# EasyEDA Pro project ProProject_步进驱动V1.1.02_2023-12-25.epro

# Schematic Schematic1
Create Date: 2023-08-16; Page Name: P1; Project Name: 步进驱动V1.1.02; Schematic Name: Schematic1; Update Date: 2023-08-25; Company: 嘉立创EDA; Page Size: A4; Version: V1.0
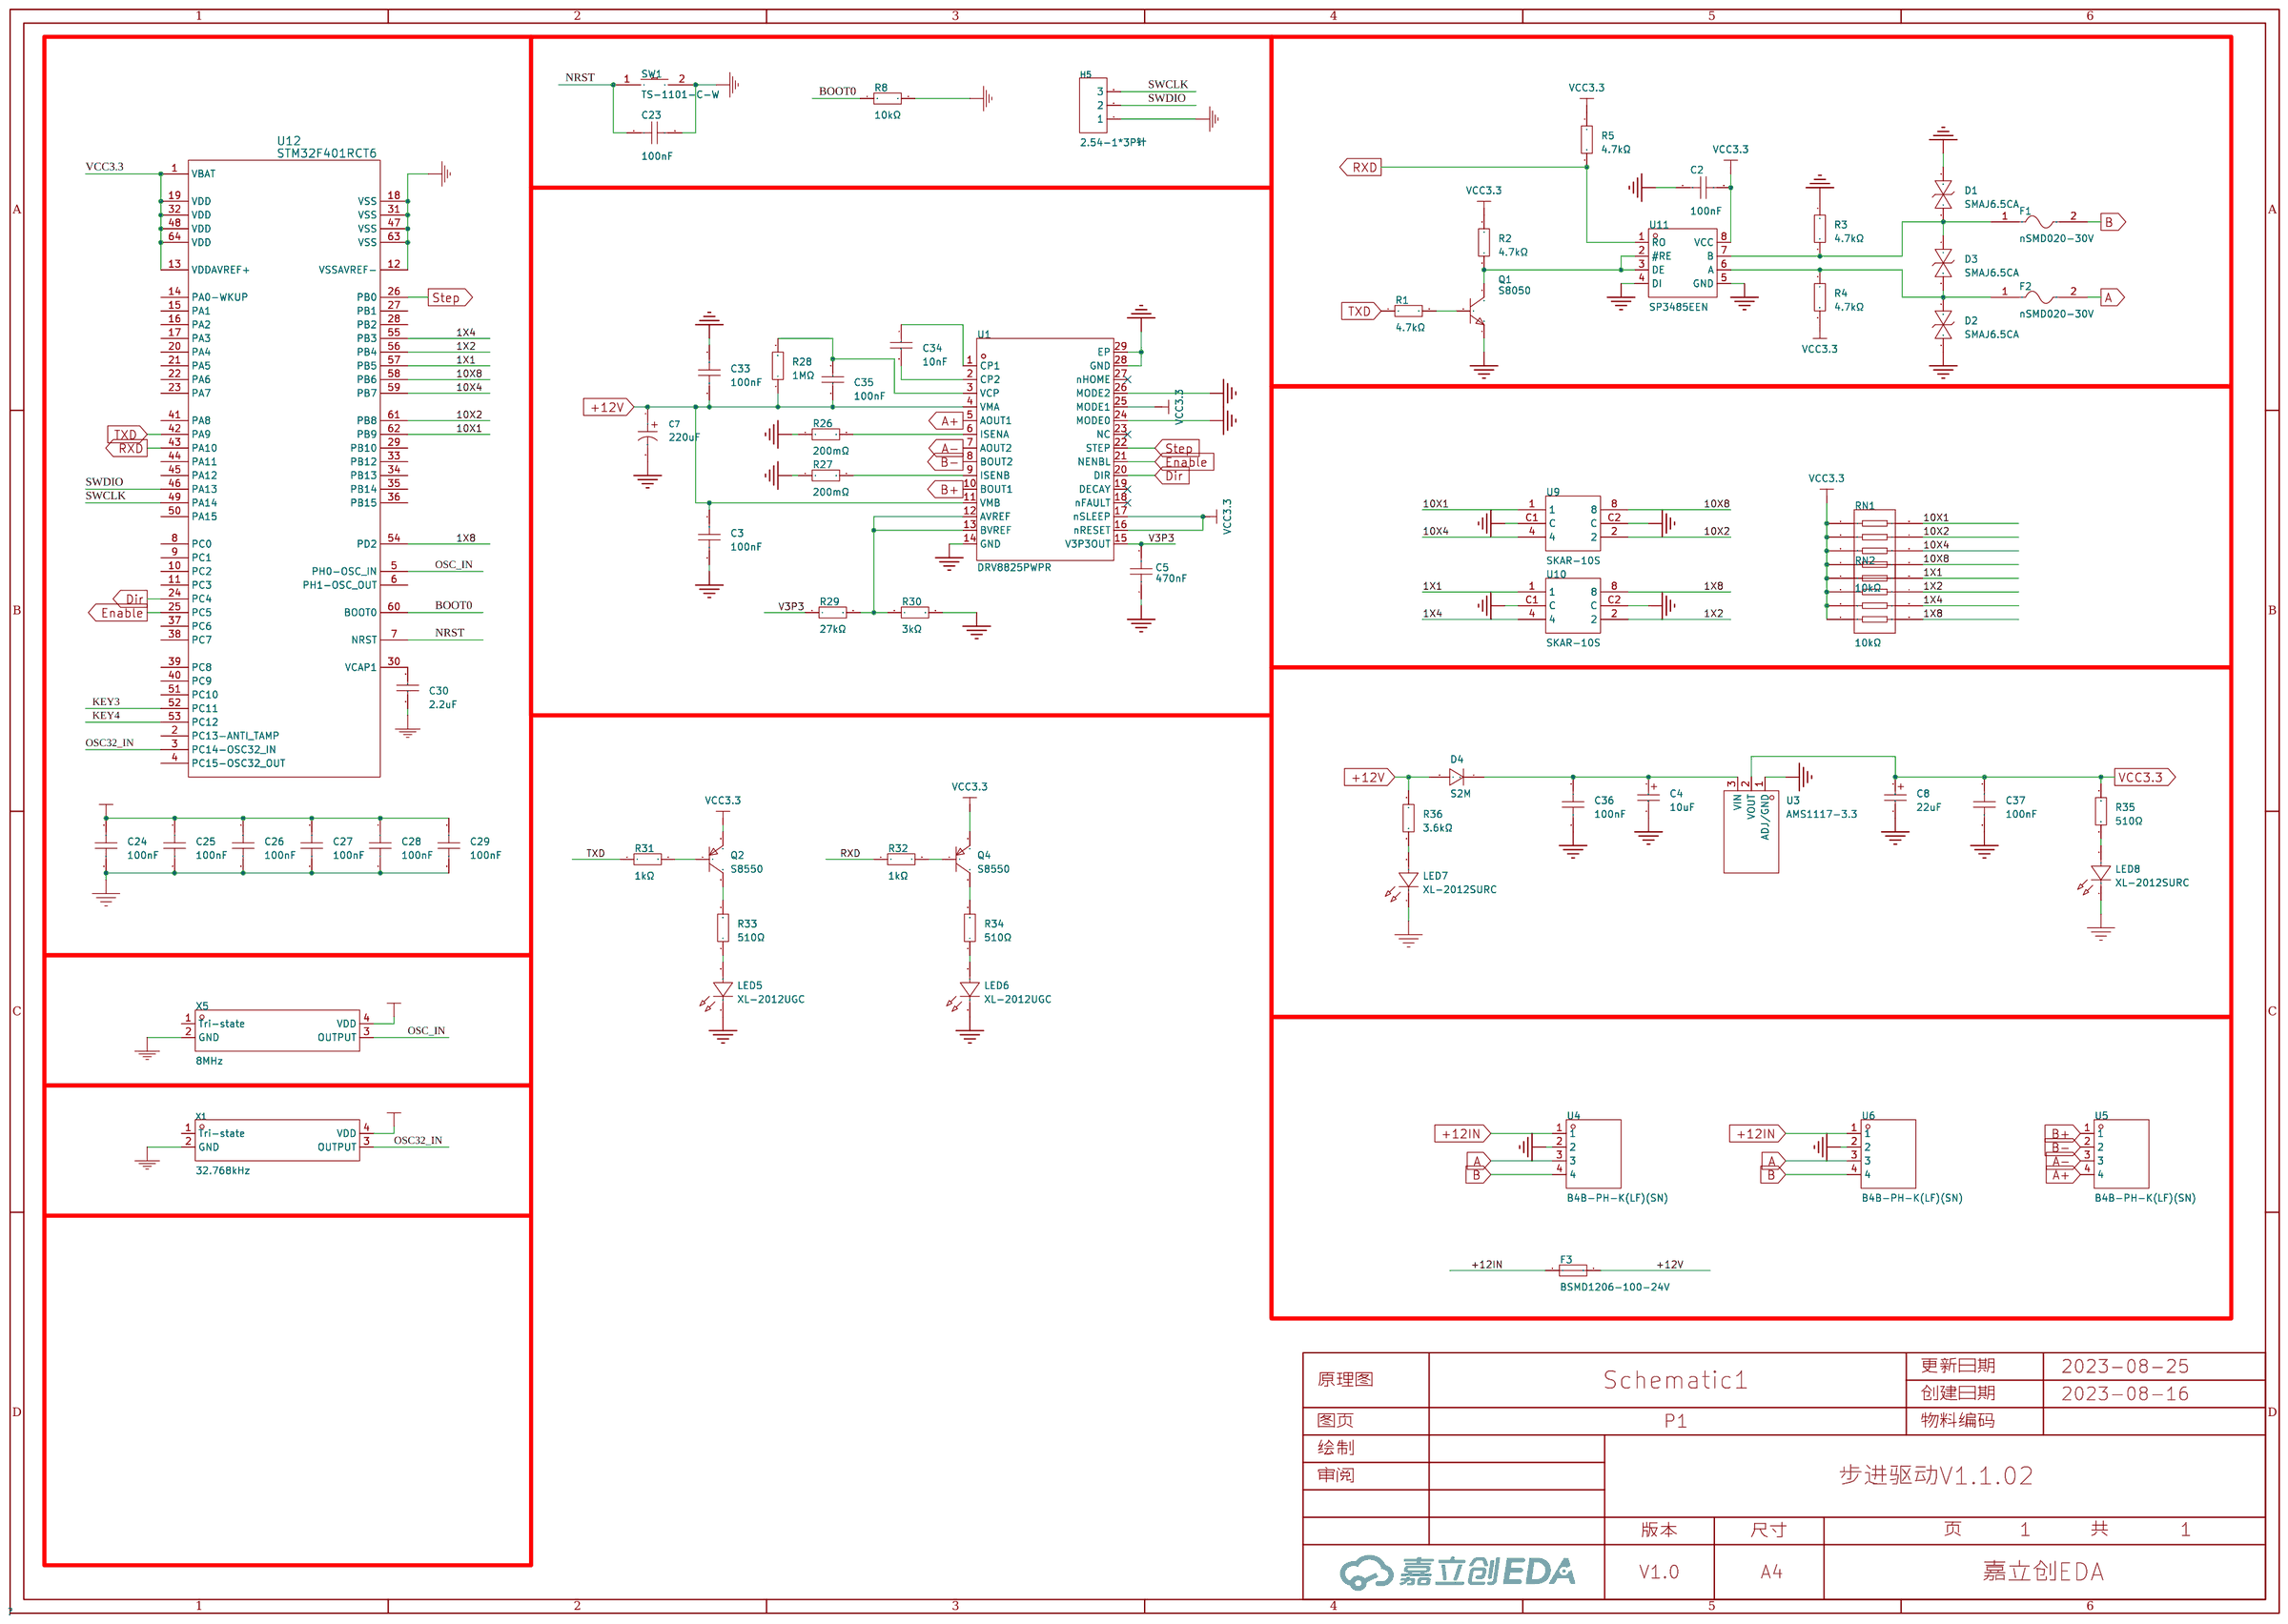
[diagram p0: schematic sheet]

## Parts
C2  100nF  [C0603]
C3  100nF  [C0603]
C4  10uF  [CAP-SMD_L3.2-W1.6-RD]
C5  470nF  [C0603]
C7  220uF  [CAP-SMD_BD6.3-L6.6-W6.6-FD]
C8  22uF  [CAP-SMD_L3.5-W2.8-R-RD]
C23  100nF  [C0603]
C24  100nF  [C0603]
C25  100nF  [C0603]
C26  100nF  [C0603]
C27  100nF  [C0603]
C28  100nF  [C0603]
C29  100nF  [C0603]
C30  2.2uF  [C0603]
C33  100nF  [C0603]
C34  10nF  [C0603]
C35  100nF  [C0603]
C36  100nF  [C0603]
C37  100nF  [C0603]
D1  SMAJ6.5CA  [SMA_L4.3-W2.5-LS5.0-BI]
D2  SMAJ6.5CA  [SMA_L4.3-W2.5-LS5.0-BI]
D3  SMAJ6.5CA  [SMA_L4.3-W2.5-LS5.0-BI]
D4  S2M  [SMA_L4.4-W2.8-LS5.4-RD]
F1  nSMD020-30V  [F1206]
F2  nSMD020-30V  [F1206]
F3  BSMD1206-100-24V  [F1206]
H5  2.54-1*3P针  [HDR-TH_3P-P2.54-V-M-1]
LED5  XL-2012UGC  [LED0805-RD_GREEN]
LED6  XL-2012UGC  [LED0805-RD_GREEN]
LED7  XL-2012SURC  [LED0805-RD_RED]
LED8  XL-2012SURC  [LED0805-RD_RED]
Q1  S8050  [SOT-23-3_L2.9-W1.6-P1.90-LS2.8-BR]
Q2  S8550  [SOT-23-3_L2.9-W1.6-P1.90-LS2.8-BR]
Q4  S8550  [SOT-23-3_L2.9-W1.6-P1.90-LS2.8-BR]
R1  4.7kΩ  [R0603]
R2  4.7kΩ  [R0603]
R3  4.7kΩ  [R0603]
R4  4.7kΩ  [R0603]
R5  4.7kΩ  [R0603]
R8  10kΩ  [R0603]
R26  200mΩ  [R0603]
R27  200mΩ  [R0603]
R28  1MΩ  [R0603]
R29  27kΩ  [R0603]
R30  3kΩ  [R0603]
R31  1kΩ  [R0603]
R32  1kΩ  [R0603]
R33  510Ω  [R0603]
R34  510Ω  [R0603]
R35  510Ω  [R0603]
R36  3.6kΩ  [R0603]
RN1  10kΩ  [RES-ARRAY-SMD_0603-8P-L3.2-W1.6-BL]
RN2  10kΩ  [RES-ARRAY-SMD_0603-8P-L3.2-W1.6-BL]
SW1  TS-1101-C-W  [SW-SMD_L6.0-W3.3-LS8.0]
U1  DRV8825PWPR  [HTSSOP-28_L9.7-W4.4-P0.65-LS6.4-BL-EP]
U3  AMS1117-3.3  [SOT-89-3_L4.5-W2.5-P1.50-LS4.2-BR]
U4  B4B-PH-K(LF)(SN)  [CONN-TH_B4B-PH-K-LF-SN]
U5  B4B-PH-K(LF)(SN)  [CONN-TH_B4B-PH-K-LF-SN]
U6  B4B-PH-K(LF)(SN)  [CONN-TH_B4B-PH-K-LF-SN]
U9  SKAR-10S  [SW-SMD_SKAR-10S]
U10  SKAR-10S  [SW-SMD_SKAR-10S]
U11  SP3485EEN  [SOP-8_L5.0-W4.0-P1.27-LS6.0-BL]
U12  STM32F401RCT6  [LQFP-64_L10.0-W10.0-P0.50-LS12.0-BL]
X1  32.768kHz  [OSC-SMD_4P-L3.2-W2.5-BL_SIT8008BI]
X5  8MHz  [OSC-SMD_4P-L3.2-W2.5-BL]

## Library data of the parts
C2 C3 C23-C29 C33 C36 C37 = CC0603KRX7R9BB104: 容值:100nF;精度:±10%;额定电压:50V;材质(温度系数):X7R;; LCSC Part Name: 100nF ±10% 50V; Supplier Part: C14663; Manufacturer: YAGEO(国巨); Supplier Footprint: 0603; JLCPCB Part Class: 基础库; Datasheet: https://atta.szlcsc.com/upload/public/pdf/source/20180910/C282072_33301C7F631E79921B82A8DAC6BCC5B3.pdf; Supplier: LCSC; Tolerance: ±10%; Voltage Rated: 50V; Temperature Coefficient: X7R
C4 = CA45-A-16V-10uF-K: 容值:10uF;精度:±10%;额定电压:16V;等效串联电阻:10Ω@100kHz;; LCSC Part Name: 10uF ±10% 16V; Supplier Part: C128254; Manufacturer: CEC(振华新云); Supplier Footprint: CASE-A-3216; JLCPCB Part Class: 扩展库; Datasheet: https://atta.szlcsc.com/upload/public/pdf/source/20170914/C128254_1505359752472967905.pdf; Supplier: LCSC; Tolerance: ±10%; Rated Voltage: 16V; Equivalent Series Resistance(ESR): 10Ω@100kHz; Operating Temperature: -55℃~+125℃
C5 = CC0603KRX5R5BB474: 容值:470nF;精度:±10%;额定电压:6.3V;材质(温度系数):X5R;; LCSC Part Name: 470nF ±10% 6.3V; Supplier Part: C327224; Manufacturer: YAGEO(国巨); Supplier Footprint: 0603; JLCPCB Part Class: 扩展库; Supplier: LCSC; Tolerance: ±10%; Voltage Rated: 6.3V; Temperature Coefficient: X5R
C7 = RVT220UF16V67RV0015: 容值:220uF;精度:±20%;额定电压:16V;纹波电流:110mA@120Hz;等效串联电阻:-;; LCSC Part Name: 220uF ±20% 16V; Supplier Part: C2887273; Manufacturer: KNSCHA(科尼盛); Supplier Footprint: SMD,D6.3xL7.7mm; JLCPCB Part Class: 扩展库; Datasheet: https://atta.szlcsc.com/upload/public/pdf/source/20210824/3DC9999D9B098FE241E3A26137981C4C.pdf; Supplier: LCSC; Tolerance: ±20%; Rated Voltage: 16V; φD: 6.3mm; L: 7.7mm; Ripple Current: 110mA@120Hz; Lifetime @ Temp: 2000hrs@105℃; Operating Temperature: -55℃~+105℃
C8 = CA45-B016K226T: 容值:22uF;精度:±10%;额定电压:16V;等效串联电阻:2.2Ω@100kHz;; LCSC Part Name: 22uF ±10% 16V; Supplier Part: C122226; Manufacturer: 湘怡中元/湘江; Supplier Footprint: CASE-B-3528; JLCPCB Part Class: Extended Part; Datasheet: https://atta.szlcsc.com/upload/public/pdf/source/20181017/C122226_7DF2DDC4632F4396103DFFBF0BD6155C.pdf; Supplier: LCSC; Tolerance: ±10%; Rated Voltage: 16V; Equivalent Series Resistance(ESR): 2.2Ω@100kHz; Operating Temperature: -55℃~+125℃
C30 = 0603B225K250NT: 容值:2.2uF;精度:±10%;额定电压:25V;材质(温度系数):X7R;; LCSC Part Name: 2.2uF ±10% 25V; Supplier Part: C99228; Manufacturer: FH(风华); Supplier Footprint: 0603; JLCPCB Part Class: 扩展库; Datasheet: https://atta.szlcsc.com/upload/public/pdf/source/20170923/C99228_1506149582167989005.pdf; Supplier: LCSC; Tolerance: ±10%; Voltage Rated: 25V; Temperature Coefficient: X7R
C34 = CC0603KRX7R9BB103: 容值:10nF;精度:±10%;额定电压:50V;材质(温度系数):X7R;; LCSC Part Name: 10nF ±10% 50V; Supplier Part: C100042; Manufacturer: YAGEO(国巨); Supplier Footprint: 0603; JLCPCB Part Class: 扩展库; Datasheet: https://atta.szlcsc.com/upload/public/pdf/source/20180326/C100042_E8B0111D51DE3671A0A4A59FBCEFE81C.pdf; Supplier: LCSC; Tolerance: ±10%; Voltage Rated: 50V; Temperature Coefficient: X7R
C35 = CL10B104KO8NNNC: 容值:100nF;精度:±10%;额定电压:16V;材质(温度系数):X7R;; LCSC Part Name: 100nF ±10% 16V; Supplier Part: C66501; Manufacturer: SAMSUNG(三星); Supplier Footprint: 0603; JLCPCB Part Class: 扩展库; Datasheet: https://atta.szlcsc.com/upload/public/pdf/source/20160218/1457707763339.pdf; Supplier: LCSC; Tolerance: ±10%; Voltage Rated: 16V; Temperature Coefficient: X7R
D1-D3 = SMAJ6.5CA_C726773: 极性:双向;; LCSC Part Name: 双向; Supplier Part: C726773; Manufacturer: TWGMC(台湾迪嘉); Supplier Footprint: SMA; JLCPCB Part Class: 扩展库; Datasheet: https://atta.szlcsc.com/upload/public/pdf/source/20200827/C726731_3930C18E0BE7F90724BF034A8102E5CA.pdf; Supplier: LCSC; Polarity: 双向
D4 = S2M_C18905: 二极管配置:-;直流反向耐压(Vr):1kV;平均整流电流(Io):2A;正向压降(Vf):1.1V@2A;反向电流(Ir):5uA@1kV;; LCSC Part Name: 1kV 2A 1.1V@2A; Supplier Part: C18905; Manufacturer: MDD; Supplier Footprint: SMA(DO-214AC); JLCPCB Part Class: 扩展库; Datasheet: https://atta.szlcsc.com/upload/public/pdf/source/20230314/14BD280075F8F5C2EBB2216FE456DD68.pdf; Supplier: LCSC; Reverse Voltage (Vr): 1kV; Average Rectified Current (Io): 2A; Forward Voltage (Vf@If): 1.1V@2A; Reverse Leakage Current: 5uA@1kV
F1 F2 = nSMD020-30V: 最大电压:30V;最大电流:100A;保持电流:200mA;跳闸电流:460mA;; LCSC Part Name: 30V 200mA 1206自恢复; Supplier Part: C69680; Manufacturer: 台湾陆海; Supplier Footprint: 1206; JLCPCB Part Class: 扩展库; Datasheet: https://atta.szlcsc.com/upload/public/pdf/source/20230404/9F5B471D89C649BCC2835D46521A6324.pdf; Supplier: LCSC; Operating Voltage (Max): 30V; Current Rating (Max): 100A; Hold Current: 200mA; Trip Current: 460mA
F3 = BSMD1206-100-24V: 最大电压:24V;最大电流:40A;保持电流:1A;跳闸电流:1.8A;消耗功率:600mW;初始态阻值(最小值):50mΩ;跳断后阻值(最大值):270mΩ;最大动作时间:300ms;工作温度:-40℃~+85℃;; LCSC Part Name: 1206 1A 24V 佰宏高电压; Supplier Part: C910830; Manufacturer: BHFUSE(佰宏); Supplier Footprint: 1206; JLCPCB Part Class: 扩展库; Datasheet: https://atta.szlcsc.com/upload/public/pdf/source/20220223/F3912435B50C2DF93D2E2177EFAD108D.pdf; Supplier: LCSC; Operating Voltage (Max): 24V; Current Rating (Max): 40A; Hold Current: 1A; Trip Current: 1.8A; Power Dissipation: 600mW; Resistance - Initial (Ri) (Min): 50mΩ; Resistance - Post Trip (R1) (Max): 270mΩ; Maximum Time to Trip: 300ms; Operating Temperature: -40℃~+85℃
H5 = 2.54-1*3P针: 排数:单排;总PIN位数:3;间距:2.54mm;插针结构:1x3P;行距:-;安装类型:直插;圆针/方针:方针;额定电流:3A;额定电压:-;配合针长度:-;塑高:-;端接针长度:-;触头材质:-;触头镀层:-;工作温度范围:-40℃~+105℃;颜色:黑色;; LCSC Part Name: 2.54mm 1x3P 直插 方针; Supplier Part: C49257; Manufacturer: BOOMELE(博穆精密); Supplier Footprint: 直插,P=2.54mm; JLCPCB Part Class: 扩展库; Supplier: LCSC; Number of Rows: 单排; Number of Pins: 3; Pitch: 2.54mm; Pin Structure: 1x3P; Mounting Type: 直插; Circluar Pins/Square Pins: 方针; Current Rating (Max): 3A; Operating Temperature Range: -40℃~+105℃; Color: 黑色
LED5 LED6 = XL-2012UGC: 发光颜色:翠绿;主波长:516nm~525nm;色温:-;功率:80mW;安装方式:正贴;; LCSC Part Name: 翠绿 正贴; Supplier Part: C965815; Manufacturer: XINGLIGHT(成兴光); Supplier Footprint: 0805; JLCPCB Part Class: 扩展库; Datasheet: https://atta.szlcsc.com/upload/public/pdf/source/20221102/ACA6CBC413A1A8AF38BEBA54306464BE.pdf; Supplier: LCSC; Emitted Color: 翠绿; Lens Color: 无色透明; Dominant Wavelength: 516nm~525nm; Peak Wavelength: 534nm; Forward Current: 25mA; Power Dissipation: 80mW; Viewing Angle: 120°; Mounting Sytle: 正贴; Operating Temperature: -30℃~+85℃
LED7 LED8 = XL-2012SURC: 发光颜色:红灯;主波长:617nm~621nm;色温:-;功率:55mW;安装方式:正贴;; LCSC Part Name: 红灯 正贴; Supplier Part: C965812; Manufacturer: XINGLIGHT(成兴光); Supplier Footprint: 0805; JLCPCB Part Class: 扩展库; Datasheet: https://atta.szlcsc.com/upload/public/pdf/source/20221102/49E1A0A365644091E6270AF1C5E0FE37.pdf; Supplier: LCSC; Emitted Color: 红灯; Lens Color: 无色透明; Dominant Wavelength: 617nm~621nm; Peak Wavelength: 623nm; Forward Current: 25mA; Power Dissipation: 55mW; Viewing Angle: 120°; Mounting Sytle: 正贴; Operating Temperature: -30℃~+85℃
Q1 = S8050_C105433: 晶体管类型:NPN;集射极击穿电压(Vceo):25V;集电极电流(Ic):500mA;功率(Pd):300mW;直流电流增益(hFE@Ic,Vce):120@50mA,1V;; LCSC Part Name: NPN 25V 500mA L档 120-200; Supplier Part: C105433; Manufacturer: CJ(江苏长电/长晶); Supplier Footprint: SOT-23; JLCPCB Part Class: 扩展库; Datasheet: https://atta.szlcsc.com/upload/public/pdf/source/20170415/1492237762328.pdf; Supplier: LCSC; Transistor Type: NPN; Collector-Emitter Breakdown Voltage (Vceo): 25V; Collector Current (Ic): 500mA; Power Dissipation (Pd): 300mW; Collector Cut-Off Current (Icbo): 100nA; Collector-Emitter Saturation Voltage (VCE(sat)@Ic,Ib): 600mV@500mA,50mA; DC Current Gain (hFE@Ic,Vce): 120@50mA,1V; Transition Frequency (fT): 150MHz; Operating Temperature: +150℃@(Tj)
Q2 Q4 = S8550_C105432: 晶体管类型:PNP;集射极击穿电压(Vceo):25V;集电极电流(Ic):500mA;功率(Pd):300mW;直流电流增益(hFE@Ic,Vce):120@50mA,1V;; LCSC Part Name: PNP 25V 500mA L档120-200; Supplier Part: C105432; Manufacturer: CJ(江苏长电/长晶); Supplier Footprint: SOT-23; JLCPCB Part Class: 基础库; Datasheet: https://atta.szlcsc.com/upload/public/pdf/source/20170413/1492062713649.pdf; Supplier: LCSC; Transistor Type: PNP; Collector-Emitter Breakdown Voltage (Vceo): 25V; Collector Current (Ic): 500mA; Power Dissipation (Pd): 300mW; Collector Cut-Off Current (Icbo): 100nA; Collector-Emitter Saturation Voltage (VCE(sat)@Ic,Ib): 600mV@500mA,50mA; DC Current Gain (hFE@Ic,Vce): 120@50mA,1V; Transition Frequency (fT): 150MHz; Operating Temperature: +150℃@(Tj)
R1-R5 = 0603WAF4701T5E: 电阻类型:厚膜电阻;阻值:4.7kΩ;精度:±1%;功率:100mW;; LCSC Part Name: 4.7kΩ ±1% 100mW; Supplier Part: C23162; Manufacturer: UNI-ROYAL(厚声); Supplier Footprint: 0603; JLCPCB Part Class: 基础库; Datasheet: https://atta.szlcsc.com/upload/public/pdf/source/20200306/C422600_1E6D84923E4A46A82E41ADD87F860B5C.pdf; Supplier: LCSC; Type: 厚膜电阻; Tolerance: ±1%; Power(Watts): 100mW; Temperature Coefficient: ±100ppm/℃; Overload Voltage (Max): 75V; Operating Temperature Range: -55℃~+155℃
R8 = 0603WAF1002T5E: 电阻类型:厚膜电阻;阻值:10kΩ;精度:±1%;功率:100mW;; LCSC Part Name: 厚膜电阻 10kΩ ±1% 100mW; Supplier Part: C25804; Manufacturer: UNI-ROYAL(厚声); Supplier Footprint: 0603; JLCPCB Part Class: 基础库; Datasheet: https://atta.szlcsc.com/upload/public/pdf/source/20200306/C422600_1E6D84923E4A46A82E41ADD87F860B5C.pdf; Supplier: LCSC; Type: 厚膜电阻; Tolerance: ±1%; Power(Watts): 100mW; Temperature Coefficient: ±100ppm/℃; Overload Voltage (Max): 75V; Operating Temperature Range: -55℃~+155℃
R26 R27 = 0603WAF200LT5E: 电阻类型:厚膜电阻;阻值:200mΩ;精度:±1%;功率:100mW;; LCSC Part Name: 200mΩ ±1% 100mW; Supplier Part: C79773; Manufacturer: UNI-ROYAL(厚声); Supplier Footprint: 0603; JLCPCB Part Class: 扩展库; Datasheet: https://atta.szlcsc.com/upload/public/pdf/source/20200306/C422600_1E6D84923E4A46A82E41ADD87F860B5C.pdf; Supplier: LCSC; Type: 厚膜电阻; Tolerance: ±1%; Power(Watts): 100mW; Temperature Coefficient: ±800ppm/℃; Overload Voltage (Max): 75V; Operating Temperature Range: -55℃~+155℃
R28 = 0603WAF1004T5E: 电阻类型:厚膜电阻;阻值:1MΩ;精度:±1%;功率:100mW;; LCSC Part Name: 1MΩ ±1% 100mW; Supplier Part: C22935; Manufacturer: UNI-ROYAL(厚声); Supplier Footprint: 0603; JLCPCB Part Class: 基础库; Datasheet: https://atta.szlcsc.com/upload/public/pdf/source/20200306/C422600_1E6D84923E4A46A82E41ADD87F860B5C.pdf; Supplier: LCSC; Type: 厚膜电阻; Tolerance: ±1%; Power(Watts): 100mW; Temperature Coefficient: ±100ppm/℃; Overload Voltage (Max): 75V; Operating Temperature Range: -55℃~+155℃
R29 = 0603WAF2702T5E: 电阻类型:厚膜电阻;阻值:27kΩ;精度:±1%;功率:100mW;; LCSC Part Name: 27kΩ ±1% 100mW; Supplier Part: C22967; Manufacturer: UNI-ROYAL(厚声); Supplier Footprint: 0603; JLCPCB Part Class: 基础库; Datasheet: https://atta.szlcsc.com/upload/public/pdf/source/20200306/C422600_1E6D84923E4A46A82E41ADD87F860B5C.pdf; Supplier: LCSC; Type: 厚膜电阻; Tolerance: ±1%; Power(Watts): 100mW; Temperature Coefficient: ±100ppm/℃; Overload Voltage (Max): 75V; Operating Temperature Range: -55℃~+155℃
R30 = 0603WAF3001T5E: 电阻类型:厚膜电阻;阻值:3kΩ;精度:±1%;功率:100mW;; LCSC Part Name: 3kΩ ±1% 100mW; Supplier Part: C4211; Manufacturer: UNI-ROYAL(厚声); Supplier Footprint: 0603; JLCPCB Part Class: 基础库; Datasheet: https://atta.szlcsc.com/upload/public/pdf/source/20200306/C422600_1E6D84923E4A46A82E41ADD87F860B5C.pdf; Supplier: LCSC; Type: 厚膜电阻; Tolerance: ±1%; Power(Watts): 100mW; Temperature Coefficient: ±100ppm/℃; Overload Voltage (Max): 75V; Operating Temperature Range: -55℃~+155℃
R31 R32 = 0603WAF1001T5E: 电阻类型:厚膜电阻;阻值:1kΩ;精度:±1%;功率:100mW;; LCSC Part Name: 1kΩ ±1% 100mW; Supplier Part: C21190; Manufacturer: UNI-ROYAL(厚声); Supplier Footprint: 0603; JLCPCB Part Class: 基础库; Datasheet: https://atta.szlcsc.com/upload/public/pdf/source/20200306/C422600_1E6D84923E4A46A82E41ADD87F860B5C.pdf; Supplier: LCSC; Type: 厚膜电阻; Tolerance: ±1%; Power(Watts): 100mW; Temperature Coefficient: ±100ppm/℃; Overload Voltage (Max): 75V; Operating Temperature Range: -55℃~+155℃
R33-R35 = 0603WAF5100T5E: 电阻类型:厚膜电阻;阻值:510Ω;精度:±1%;功率:100mW;; LCSC Part Name: 510Ω ±1% 100mW; Supplier Part: C23193; Manufacturer: UNI-ROYAL(厚声); Supplier Footprint: 0603; JLCPCB Part Class: Basic Part; Datasheet: https://atta.szlcsc.com/upload/public/pdf/source/20200306/C422600_1E6D84923E4A46A82E41ADD87F860B5C.pdf; Supplier: LCSC; Type: 厚膜电阻; Tolerance: ±1%; Power(Watts): 100mW; Temperature Coefficient: ±100ppm/℃; Overload Voltage (Max): 75V; Operating Temperature Range: -55℃~+155℃
R36 = 0603WAF3601T5E: 电阻类型:厚膜电阻;阻值:3.6kΩ;精度:±1%;功率:100mW;; LCSC Part Name: 3.6kΩ ±1% 100mW; Supplier Part: C22980; Manufacturer: UNI-ROYAL(厚声); Supplier Footprint: 0603; JLCPCB Part Class: Basic Part; Datasheet: https://atta.szlcsc.com/upload/public/pdf/source/20200306/C422600_1E6D84923E4A46A82E41ADD87F860B5C.pdf; Supplier: LCSC; Type: 厚膜电阻; Tolerance: ±1%; Power(Watts): 100mW; Temperature Coefficient: ±100ppm/℃; Overload Voltage (Max): 75V; Operating Temperature Range: -55℃~+155℃
RN1 RN2 = 4D03WGJ0103T5E: 阻值:10kΩ;精度:±5%;单个元件功率:62.5mW;电阻器数:4;; LCSC Part Name: 10kΩ ±5%; Supplier Part: C29718; Manufacturer: UNI-ROYAL(厚声); Supplier Footprint: 0603x4; JLCPCB Part Class: 基础库; Datasheet: https://atta.szlcsc.com/upload/public/pdf/source/20170615/1497511005633.pdf; Supplier: LCSC; Tolerance: ±5%; Power(Watts): 62.5mW; Number of Resistors: 4; Number of Pins: 8; Temperature Coefficient: ±200ppm/℃
SW1 = TS-1101-C-W: 触点电流:50mA;额定电压(AC):-;额定电压(DC):12V;额定功率:-;绝缘电阻:-;电路结构:单刀单掷;安装方式:立贴;带灯:无;作用力:260gf;机械寿命:5万次;带支架:否;; LCSC Part Name: 立贴 6*3.6*2.5mm 轻触开关 一型3*6*2.5有白ZD b拉伸白色带淡绿按键 卷装; Supplier Part: C318938; Manufacturer: XKB Connectivity(中国星坤); Supplier Footprint: SMD; JLCPCB Part Class: 扩展库; Datasheet: https://atta.szlcsc.com/upload/public/pdf/source/20200227/C318938_C2E53B1EEDE37D980A33616AC086DE53.pdf; Supplier: LCSC; Contact Current: 50mA; Voltage Rating (DC): 12V; Circuit: 单刀单掷; Mounting Style: 立贴; Actuator Style: 矩形按钮; Actuator/Cap Color: 白色带淡绿; With Lamp: 无; Operating Force: 260gf; Mechanical Life: 5万次; Operating Temperature: -30℃~+85℃; Switch Length: 6mm; Switch Width: 3.6mm; Switch Height: 2.5mm; Strike Gundam: 否
U1 = DRV8825PWPR: 类型:-;电源电压:8.2V~45V;输出电流:2.5A;接口:-;; Supplier Part: C81582; Manufacturer: TI(德州仪器); Supplier Footprint: HTSSOP-28-EP; JLCPCB Part Class: 扩展库; Datasheet: https://atta.szlcsc.com/upload/public/pdf/source/20161207/1481104165111.pdf; Supplier: LCSC; Supply Voltage: 8.2V~45V; Output Current: 2.5A; Operating Temperature: -40℃~+150℃@(Tj)
U3 = AMS1117-3.3_C880752: 输出类型:-;; Supplier Part: C880752; Manufacturer: Slkor(萨科微); Supplier Footprint: SOT-89-3; JLCPCB Part Class: 扩展库; Datasheet: https://atta.szlcsc.com/upload/public/pdf/source/20201231/C426566_7F22DB93439D00F3FA27143E4F28C6AA.pdf; Supplier: LCSC
U4-U6 = B4B-PH-K(LF)(SN): 参考系列:PH;间距:2mm;插针结构:1x4P;排数:1;每排PIN数:4;行距:-;安装方式:-;触头材质:黄铜;; LCSC Part Name: PH 2mm 1x4P; Supplier Part: C265289; Manufacturer: JST; Supplier Footprint: 直插,P=2mm; JLCPCB Part Class: 扩展库; Datasheet: https://atta.szlcsc.com/upload/public/pdf/source/20181024/C265289_8AD58A082EB90E807312EB2A7830A4E1.pdf; Supplier: LCSC; Reference Series: PH; Pitch: 2mm; Pins Structure: 1x4P; Number of Rows: 1; Number of PINs Per Row: 4; Contact Material: 黄铜
U9 U10 = SKAR-10S: 类型:贴片型;; LCSC Part Name: 旋转编码开关/8421开关/BCD编码开关; Supplier Part: C2841466; Manufacturer: SM Switch; Supplier Footprint: SMD; JLCPCB Part Class: 扩展库; Datasheet: https://atta.szlcsc.com/upload/public/pdf/source/20211026/BE4A0CBC2E7B813E59BDAB68EBCE2F29.pdf; Supplier: LCSC; Type: 贴片型
U11 = SP3485EEN: Supplier Part: C668205; Manufacturer: UMW(广东友台半导体); Supplier Footprint: SOP-8; JLCPCB Part Class: 扩展库; Datasheet: https://atta.szlcsc.com/upload/public/pdf/source/20221009/2FEF7A2E83435CC21653A42B67D28760.pdf; Supplier: LCSC
U12 = STM32F401RCT6: Supplier: LCSC; Manufacturer: STMicroelectronics; Supplier Part: C74524; JLCPCB Part Class: Extended Part; link: https://item.szlcsc.com/92458.html; 3DModel: LQFP-64_L10.0-W10.0-H1.4-LS12.0-P0.50
X1 = S3D32.768KB20F30T: 频率:32.768kHz;频率稳定度:±20ppm;工作电压:3.3V;输出模式:CMOS;; LCSC Part Name: 32.768kHz ±20ppm 3.3V CMOS; Supplier Part: C387415; Manufacturer: SCTF(星通时频); Supplier Footprint: SMD3225-4P; JLCPCB Part Class: 扩展库; Datasheet: https://atta.szlcsc.com/upload/public/pdf/source/20220907/EE78A4BA56F6C8FCA9763B3CAD0160B4.pdf; Supplier: LCSC; Frequency Stability: ±20ppm; Supply Voltage: 3.3V; Supply Current (Max): 90uA; Output Type: CMOS; Operating Temperature: -40℃~+85℃
X5 = OT32258MJBA4SL: 频率:8MHz;频率稳定度:±10ppm;工作电压:1.8V~3.3V;; LCSC Part Name: 8MHz ±10ppm 1.8V~3.3V YSO110TR; Supplier Part: C717687; Manufacturer: YXC(扬兴晶振); Supplier Footprint: SMD3225-4P; JLCPCB Part Class: 扩展库; Datasheet: https://atta.szlcsc.com/upload/public/pdf/source/20210329/C669065_30B18CFE780D377BA4E84F6ED1951959.pdf; Supplier: LCSC; Frequency Stability: ±10ppm; Supply Voltage: 1.8V~3.3V; Operating Temperature: -40℃~+85℃

## Nets
+12V: C3.1 C7.1 C33.2 C35.2 D4.2(A) F3.2 R28.1 R36.1 U1.4(VMA) U1.11(VMB)
GND: C2.1 C3.2 C4.2 C5.1 C7.2 C8.2 C23.2 C24.2 C25.2 C26.2 C27.2 C28.2 C29.2 C30.1 C33.1 C36.2 C37.2 D1.1 D2.2 H5.1 LED5.1(K) LED6.1(K) LED7.1(K) LED8.1(K) Q1.2 R3.1 R8.2 R26.1 R27.1 R30.2 SW1.2 U1.14(GND) U1.24(MODE0) U1.26(MODE2) U1.28(GND) U1.29(EP) U3.1(ADJ/GND) U4.2 U6.2 U9.C1(C) U9.C2(C) U10.C1(C) U10.C2(C) U11.4(DI) U11.5(GND) U12.12(VSSAVREF-) U12.18(VSS) U12.31(VSS) U12.47(VSS) U12.63(VSS) X1.2(GND) X5.2(GND)
V3P3: C5.2 R29.1 U1.15(V3P3OUT)
VCC3.3: C2.2 C8.1 C24.1 C25.1 C26.1 C27.1 C28.1 C29.1 C37.1 Q2.2 Q4.2 R2.1 R4.2 R5.1 R35.2 RN1.1 RN1.2 RN1.3 RN1.4 RN2.1 RN2.2 RN2.3 RN2.4 U1.16(nRESET) U1.17(nSLEEP) U1.25(MODE1) U3.2(VOUT) U11.8(VCC) U12.1(VBAT) U12.13(VDDAVREF+) U12.19(VDD) U12.32(VDD) U12.48(VDD) U12.64(VDD) X1.4(VDD) X5.4(VDD)
1X1: RN2.8 U10.1 U12.57(PB5)
1X2: RN2.7 U10.2 U12.56(PB4)
1X4: RN2.6 U10.4 U12.55(PB3)
1X8: RN2.5 U10.8 U12.54(PD2)
10X1: RN1.8 U9.1 U12.62(PB9)
10X2: RN1.7 U9.2 U12.61(PB8)
10X4: RN1.6 U9.4 U12.59(PB7)
10X8: RN1.5 U9.8 U12.58(PB6)
+12IN: F3.1 U4.1 U6.1
A: F2.2 U4.3 U6.3
A+: U1.5(AOUT1) U5.4
A-: U1.7(AOUT2) U5.3
B: F1.2 U4.4 U6.4
B+: U1.10(BOUT1) U5.1
B-: U1.8(BOUT2) U5.2
BOOT0: R8.1 U12.60(BOOT0)
Dir: U1.20(DIR) U12.24(PC4)
Enable: U1.21(NENBL) U12.25(PC5)
KEY3: U12.52(PC11)
KEY4: U12.53(PC12)
NRST: C23.1 SW1.1 U12.7(NRST)
OSC32_IN: U12.3(PC14-OSC32_IN) X1.3(OUTPUT)
OSC_IN: U12.5(PH0-OSC_IN) X5.3(OUTPUT)
RXD: R5.2 R32.1 U11.1(RO) U12.43(PA10)
Step: U1.22(STEP) U12.26(PB0)
SWCLK: H5.3 U12.49(PA14)
SWDIO: H5.2 U12.46(PA13)
TXD: R1.1 R31.1 U12.42(PA9)
$1N1217: Q1.1 R1.2
$1N1218: Q1.3 R2.2 U11.2(#RE) U11.3(DE)
$1N1230: D1.2 D3.1 F1.1 R3.2 U11.7(B)
$1N1231: D2.1 D3.2 F2.1 R4.1 U11.6(A)
$1N2052: C4.1 C36.1 D4.1(C) U3.3(VIN)
$1N2058: LED8.2(A) R35.1
$1N2061: LED7.2(A) R36.2
$1N2619: C30.2 U12.30(VCAP1)
$1N4237: R26.2 U1.6(ISENA)
$1N4238: R27.2 U1.9(ISENB)
$1N4249: C34.2 U1.2(CP2)
$1N4250: C34.1 U1.1(CP1)
$1N4254: C35.1 R28.2 U1.3(VCP)
$1N4266: R29.2 R30.1 U1.12(AVREF) U1.13(BVREF)
$1N6482: Q2.1 R31.2
$1N6521: Q4.1 R32.2
$1N6755: Q2.3 R33.2
$1N6785: Q4.3 R34.2
Net-(LED5-2): LED5.2(A) R33.1
Net-(LED6-2): LED6.2(A) R34.1

Not connected (* = marked no-connect by the designer): U1 18(nFAULT)* 19(DECAY)* 23(NC)* 27(nHOME)*; U12 2(PC13-ANTI_TAMP) 4(PC15-OSC32_OUT) 6(PH1-OSC_OUT) 8(PC0) 9(PC1) 10(PC2) 11(PC3) 14(PA0-WKUP) 15(PA1) 16(PA2) 17(PA3) 20(PA4) 21(PA5) 22(PA6) 23(PA7) 27(PB1) 28(PB2) 29(PB10) 33(PB12) 34(PB13) 35(PB14) 36(PB15) 37(PC6) 38(PC7) 39(PC8) 40(PC9) 41(PA8) 44(PA11) 45(PA12) 50(PA15) 51(PC10); X1 1(Tri-state); X5 1(Tri-state)

# Board PCB1
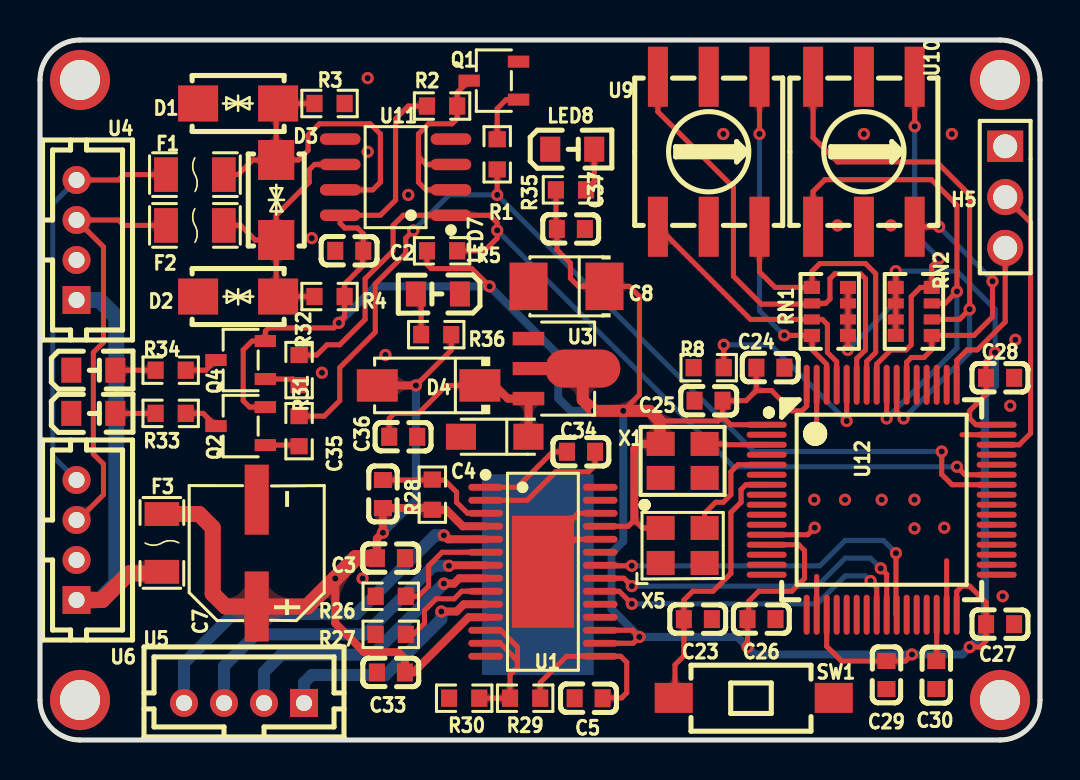
[diagram p1: board, top side]
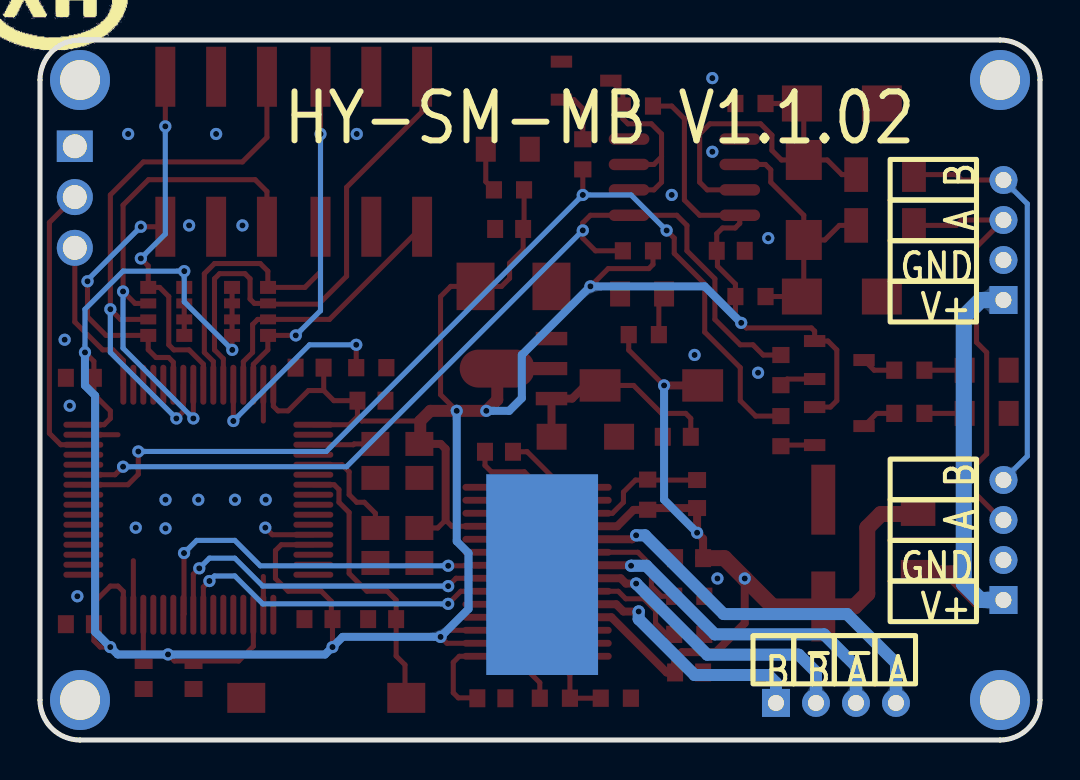
[diagram p2: board, bottom side, seen from below]

Outline 50 x 35 mm; copper layers: Top Layer, Bottom Layer. Coordinates in mm from the lower left corner of the outline.
Outline path: 0,33 0,2 arc(0.59,0.59) 2,0 48,0 arc(49.41,0.59) 50,2 50,33 arc(49.41,34.41) 48,35 2,35 arc(0.59,34.41) 0,33
Stack: Top Layer 0.035mm / Dielectric1 1.51mm FR4 er 4.5 / Bottom Layer 0.035mm

## Design rules (mm)
template: JLCPCB Capability(Two Layers Board)
spacing copperThickness1oz (default): track to track 0.102, other pairs 0.152 to 0.3
spacing copperThickness2oz: track to track 0.203, other pairs 0.152 to 0.3
track width copperThickness1oz (default): min 0.127, default 0.254, max 2.54
track width copperThickness2oz: min 0.203, default 0.254, max 2.54
differential pair differentialPair (default): width min 0.127, default 0.254, max 2.54; gap min 0.152, default 0.152
via viaSize (default): diameter min 0.5, default 0.61, max 10; hole min 0.3, default 0.305, max 6.3

## Placement (name value [footprint] x y rotation side)
C2  100nF  [C0603]  15.46 24.46 0 top
C3  100nF  [C0603]  17.55 9.09 0 top
C4  10uF  [CAP-SMD_L3.2-W1.6-RD]  22.73 15.16 180 top
C5  470nF  [C0603]  27.43 2.09 0 top
C7  220uF  [CAP-SMD_BD6.3-L6.6-W6.6-FD]  10.84 9.35 90 top
C8  22uF  [CAP-SMD_L3.5-W2.8-R-RD]  26.33 22.68 0 top
C23  100nF  [C0603]  32.89 6.04 0 top
C24  100nF  [C0603]  36.52 18.62 0 top
C25  100nF  [C0603]  33.43 16.97 180 top
C26  100nF  [C0603]  36.08 6.04 0 top
C27  100nF  [C0603]  48.01 5.79 0 top
C28  100nF  [C0603]  48.01 18.11 0 top
C29  100nF  [C0603]  42.32 3.25 270 top
C30  2.2uF  [C0603]  44.82 3.25 90 top
C33  100nF  [C0603]  17.55 3.38 0 top
C34  10nF  [C0603]  27.05 14.41 0 top
C35  100nF  [C0603]  17.15 12.3 270 top
C36  100nF  [C0603]  18.16 15.16 0 top
C37  100nF  [C0603]  26.54 25.55 0 top
D1  SMAJ6.5CA  [SMA_L4.3-W2.5-LS5.0-BI]  9.91 31.83 0 top
D2  SMAJ6.5CA  [SMA_L4.3-W2.5-LS5.0-BI]  9.91 22.17 180 top
D3  SMAJ6.5CA  [SMA_L4.3-W2.5-LS5.0-BI]  11.81 27 270 top
D4  S2M  [SMA_L4.4-W2.8-LS5.4-RD]  19.43 17.73 180 top
F1  nSMD020-30V  [F1206]  7.75 28.27 180 top
F2  nSMD020-30V  [F1206]  7.75 25.73 180 top
F3  BSMD1206-100-24V  [F1206]  6.09 9.85 90 top
H5  2.54-1*3P针  [HDR-TH_3P-P2.54-V-M-1]  48.26 27.15 270 top
LED7  XL-2012SURC  [LED0805-RD_RED]  19.9 22.3 180 top
LED8  XL-2012SURC  [LED0805-RD_RED]  26.61 29.54 0 top
NOREF  -  [Pad_e4]  48 33 0 top
NOREF#2  -  [LED0805-RD_GREEN]  2.67 16.33 0 top
NOREF#3  -  [LED0805-RD_GREEN]  2.67 18.49 0 top
NOREF#4  -  [Pad_e1239]  24.89 8.27 0 top
NOREF#5  -  [Pad_e6]  48 2 0 top
NOREF#6  -  [Pad_e5]  2 2 0 top
NOREF#7  -  [Pad_e2]  2 33 0 top
Q1  S8050  [SOT-23-3_L2.9-W1.6-P1.90-LS2.8-BR]  22.69 32.97 0 top
Q2  S8550  [SOT-23-3_L2.9-W1.6-P1.90-LS2.8-BR]  10.03 15.7 0 top
Q4  S8550  [SOT-23-3_L2.9-W1.6-P1.90-LS2.8-BR]  10.03 19 0 top
R1  4.7kΩ  [R0603]  22.86 29.28 90 top
R2  4.7kΩ  [R0603]  20.1 31.7 0 top
R3  4.7kΩ  [R0603]  14.48 31.83 180 top
R4  4.7kΩ  [R0603]  14.48 22.17 0 top
R5  4.7kΩ  [R0603]  20.1 24.46 0 top
R8  10kΩ  [R0603]  33.44 18.62 180 top
R26  200mΩ  [R0603]  17.54 7.19 0 top
R27  200mΩ  [R0603]  17.54 5.28 0 top
R28  1MΩ  [R0603]  19.62 12.27 90 top
R29  27kΩ  [R0603]  24.26 2.09 180 top
R30  3kΩ  [R0603]  21.21 2.09 180 top
R31  1kΩ  [R0603]  12.95 15.44 270 top
R32  1kΩ  [R0603]  12.95 18.5 270 top
R33  510Ω  [R0603]  6.53 16.33 0 top
R34  510Ω  [R0603]  6.53 18.49 0 top
R35  510Ω  [R0603]  26.55 27.51 180 top
R36  3.6kΩ  [R0603]  19.81 20.27 180 top
RN1  10kΩ  [RES-ARRAY-SMD_0603-8P-L3.2-W1.6-BL]  39.5 21.43 90 top
RN2  10kΩ  [RES-ARRAY-SMD_0603-8P-L3.2-W1.6-BL]  43.69 21.43 270 top
SW1  TS-1101-C-W  [SW-SMD_L6.0-W3.3-LS8.0]  35.69 2.11 0 top
U1  DRV8825PWPR  [HTSSOP-28_L9.7-W4.4-P0.65-LS6.4-BL-EP]  25.15 8.41 270 top
U3  AMS1117-3.3  [SOT-89-3_L4.5-W2.5-P1.50-LS4.2-BR]  25.78 18.57 180 top
U4  B4B-PH-K(LF)(SN)  [conn-th_b4b-ph-k-lf-sn]  1.83 25 270 top
U5  B4B-PH-K(LF)(SN)  [CONN-TH_B4B-PH-K-LF-SN]  10.2 1.85 0 top
U6  B4B-PH-K(LF)(SN)  [conn-th_b4b-ph-k-lf-sn]  1.83 10 270 top
U9  SKAR-10S  [SW-SMD_SKAR-10S]  33.44 29.41 270 top
U10  SKAR-10S  [SW-SMD_SKAR-10S]  41.19 29.41 270 top
U11  SP3485EEN  [SOP-8_L5.0-W4.0-P1.27-LS6.0-BL]  17.78 28.14 90 top
U12  STM32F401RCT6  [LQFP-64_L10.0-W10.0-P0.50-LS12.0-BL]  42.08 12.01 270 top
X1  32.768kHz  [OSC-SMD_4P-L3.2-W2.5-BL_SIT8008BI]  32.13 13.95 0 top
X5  8MHz  [OSC-SMD_4P-L3.2-W2.5-BL]  32.13 9.73 0 top

## Footprints (pads in the part's own frame, mm; a bottom-side part is the same pattern mirrored in y, then rotated)
C0603
  rect 0.8x0.9 smd: 1(-0.7,0) 2(0.7,0)
CAP-SMD_BD6.3-L6.6-W6.6-FD
  rect 3.5x1.2 smd: 1(-2.67,0) 2(2.67,0)
CAP-SMD_L3.2-W1.6-RD
  rect 1.5x1.296 smd: 1(-1.687,0) 2(1.687,0)
CAP-SMD_L3.5-W2.8-R-RD
  rect 1.9x2.376 smd: 1(1.899,0) 2(-1.899,0)
CONN-TH_B4B-PH-K-LF-SN
  rect 1.4x1.4 hole 0.8: 1(3,0)
  round 1.4 hole 0.8: 2(1,0) 3(-1,0) 4(-3,0)
conn-th_b4b-ph-k-lf-sn
  rect 1.4x1.4 hole 0.8: 1(3,0)
  round 1.4 hole 0.8: 2(1,0) 3(-1,0) 4(-3,0)
F1206
  rect 1.19x1.728 smd: 1(-1.445,0) 2(1.445,0)
HDR-TH_3P-P2.54-V-M-1
  rect 1.575x1.8 hole 1.2: 1(-2.54,0)
  round 1.8 hole 1.2: 2(0,0) 3(2.54,0)
HTSSOP-28_L9.7-W4.4-P0.65-LS6.4-BL-EP
  oval 0.343x1.732 smd: 1(-4.225,-2.866) 2(-3.575,-2.866) 3(-2.925,-2.866) 4(-2.275,-2.866) 5(-1.625,-2.866) 6(-0.975,-2.866) 7(-0.325,-2.866) 8(0.325,-2.866) 9(0.975,-2.866) 10(1.625,-2.866) 11(2.275,-2.866) 12(2.925,-2.866) 13(3.575,-2.866) 14(4.225,-2.866) 15(4.225,2.866) 16(3.575,2.866) 17(2.925,2.866) 18(2.275,2.866) 19(1.625,2.866) 20(0.975,2.866) 21(0.325,2.866) 22(-0.325,2.866) 23(-0.975,2.866) 24(-1.625,2.866) 25(-2.275,2.866) 26(-2.925,2.866) 27(-3.575,2.866) 28(-4.225,2.866)
  rect 5.6x3.1 smd: 29(0,0)
LED0805-RD_GREEN
  rect 1x1.25 smd: 1(-1.1,0) 2(1.1,0)
LED0805-RD_RED
  rect 1x1.25 smd: 1(-1.1,0) 2(1.1,0)
LQFP-64_L10.0-W10.0-P0.50-LS12.0-BL
  oval 0.3x2 smd: 1(-3.75,-5.75) 2(-3.25,-5.75) 3(-2.75,-5.75) 4(-2.25,-5.75) 5(-1.75,-5.75) 6(-1.25,-5.75) 7(-0.75,-5.75) 8(-0.25,-5.75) 9(0.25,-5.75) 10(0.75,-5.75) 11(1.25,-5.75) 12(1.75,-5.75) 13(2.25,-5.75) 14(2.75,-5.75) 15(3.25,-5.75) 16(3.75,-5.75) 33(3.75,5.75) 34(3.25,5.75) 35(2.75,5.75) 36(2.25,5.75) 37(1.75,5.75) 38(1.25,5.75) 39(0.75,5.75) 40(0.25,5.75) 41(-0.25,5.75) 42(-0.75,5.75) 43(-1.25,5.75) 44(-1.75,5.75) 45(-2.25,5.75) 46(-2.75,5.75) 47(-3.25,5.75) 48(-3.75,5.75)
  oval 2x0.3 smd: 17(5.75,-3.75) 18(5.75,-3.25) 19(5.75,-2.75) 20(5.75,-2.25) 21(5.75,-1.75) 22(5.75,-1.25) 23(5.75,-0.75) 24(5.75,-0.25) 25(5.75,0.25) 26(5.75,0.75) 27(5.75,1.25) 28(5.75,1.75) 29(5.75,2.25) 30(5.75,2.75) 31(5.75,3.25) 32(5.75,3.75) 49(-5.75,3.75) 50(-5.75,3.25) 51(-5.75,2.75) 52(-5.75,2.25) 53(-5.75,1.75) 54(-5.75,1.25) 55(-5.75,0.75) 56(-5.75,0.25) 57(-5.75,-0.25) 58(-5.75,-0.75) 59(-5.75,-1.25) 60(-5.75,-1.75) 61(-5.75,-2.25) 62(-5.75,-2.75) 63(-5.75,-3.25) 64(-5.75,-3.75)
OSC-SMD_4P-L3.2-W2.5-BL
  rect 1.4x1.2 smd: 1(-1.1,-0.875) 2(1.1,-0.875) 3(1.1,0.875) 4(-1.1,0.875)
OSC-SMD_4P-L3.2-W2.5-BL_SIT8008BI
  rect 1.4x1.2 smd: 1(-1.1,-0.85) 2(1.1,-0.85) 3(1.1,0.85) 4(-1.1,0.85)
Pad_e2
  round 3 hole 2: 5(0,0)
Pad_e4
  round 3 hole 2: 5(0,0)
Pad_e5
  round 3 hole 2: 5(0,0)
Pad_e6
  round 3 hole 2: 5(0,0)
Pad_e1239
  rect 5.588x10.033 smd far side: 65(0,0)
R0603
  rect 0.806x0.864 smd: 1(-0.753,0) 2(0.753,0)
RES-ARRAY-SMD_0603-8P-L3.2-W1.6-BL
  rect 0.65x0.8 smd: 1(-1.2,-0.9) 4(1.2,-0.9) 5(1.2,0.9) 8(-1.2,0.9)
  rect 0.5x0.8 smd: 2(-0.4,-0.9) 3(0.4,-0.9) 6(0.4,0.9) 7(-0.4,0.9)
SMA_L4.3-W2.5-LS5.0-BI
  rect 2x1.8 smd: 1(-2,0) 2(2,0)
SMA_L4.4-W2.8-LS5.4-RD
  rect 2.046x1.62 smd: 1(-2.566,0) 2(2.566,0)
SOP-8_L5.0-W4.0-P1.27-LS6.0-BL
  oval 0.574x2.035 smd: 1(-1.905,-2.768) 2(-0.635,-2.768) 3(0.635,-2.768) 4(1.905,-2.768) 5(1.905,2.768) 6(0.635,2.768) 7(-0.635,2.768) 8(-1.905,2.768)
SOT-23-3_L2.9-W1.6-P1.90-LS2.8-BR
  rect 1.07x0.6 smd: 1(1.235,-0.95) 2(1.235,0.95) 3(-1.235,0)
SOT-89-3_L4.5-W2.5-P1.50-LS4.2-BR
  rect 1.575x0.672 smd: 1(1.356,-1.5) 3(1.356,1.5)
  custom 5.377x1.9 smd: 2(-1.356,0)
SW-SMD_L6.0-W3.3-LS8.0
  rect 1.9x1.5 smd: 1(-4,0) 2(4,0)
SW-SMD_SKAR-10S
  rect 3x1 smd: 1(-3.75,2.54) 2(3.75,-2.54) 4(-3.75,-2.54) 8(3.75,2.54) C1(-3.75,0) C2(3.75,0)

## Nets
As in the schematic, except:
GND: C2.1 C3.2 C4.2 C5.1 C7.2 C8.2 C23.2 C24.2 C25.2 C26.2 C27.2 C28.2 C29.2 C30.1 C33.1 C36.2 C37.2 D1.1 D2.2 H5.1 LED7.1 LED8.1 NOREF#2.1 NOREF#3.1 NOREF#4.65 Q1.2 R3.1 R8.2 R26.1 R27.1 R30.2 SW1.2 U1.14 U1.24 U1.26 U1.28 U1.29 U3.1 U4.2 U6.2 U9.C1 U9.C2 U10.C1 U10.C2 U11.4 U11.5 U12.12 U12.18 U12.31 U12.47 U12.63 X1.2 X5.2
DIR: U1.20 U12.24
ENABLE: U1.21 U12.25
STEP: U1.22 U12.26
$1N6756: NOREF#2.2 R33.1
$1N6786: NOREF#3.2 R34.1

Pads without a net: NOREF 5; NOREF#5 5; NOREF#6 5; NOREF#7 5; U1 18 19 23 27; U12 2 4 6 8 9 10 11 14 15 16 17 20 21 22 23 27 28 29 33 34 35 36 37 38 39 40 41 44 45 50 51; X1 1; X5 1

## Via types
v1: diameter 0.61, hole 0.305, Top Layer to Bottom Layer, 63 vias

## Routing (per net, layer and track width the routed paths; a pad name or vN(x,y) marks a point on that pad's centre or on a via; arc(x,y) is an arc through that point)
+12V: length 49.3
  Top Layer w0.254: R36.1 20.56,19.5 v1(18.8,17.73)
  Top Layer w0.4: U1.11 21.43,6.14 18.67,3.38 C33.2 18.25,4.05 17.91,4.39 16.21,4.39 14.76,5.84 v1(14.76,8.08) ; v1(18.8,17.73) 16.87,17.73 ; C3.1 16.85,10.06 v1(17.15,10.36) C35.2 19.53,11.6 R28.1 19.63,11.5 20.32,11.5 21.14,10.69 U1.4
  Top Layer w0.8: 6.09,11.3 7.95,11.3 8.64,10.62 8.64,7.31 9.27,6.68 10.83,6.68 C7.1 13.36,6.68 v1(14.76,8.08) 15.78,9.09 C3.1
  Bottom Layer w0.4: v1(17.15,10.36) 18.8,12.01 v1(18.8,17.73)
GND: length 19
  Top Layer w0.254: U1.26 26.92,11.34 25.15,9.56 U1.29 26.77,10.04 U1.24 ; 47.83,15.26 46.1,15.26 ; 38.83,8.17 U12.18 ; U12.63 38.83,15.95 ; U12.12 38.38,10.26 v1(38.74,10.62) ; 45.33,6.26 45.33,8.97
  vias: v1(13.59,25.09) v1(14.1,18.36) v1(16.13,8.08) v1(16.38,33.09) v1(16.38,29.41) v1(17.27,19.25) v1(18.41,27.25) v1(34.16,30.3) v1(38.71,12.01) v1(39.88,25.73) v1(40.25,12.01) v1(41.19,30.3) v1(42.08,12.01) v1(42.54,25.73) v1(43.72,12.01) v1(43.72,10.58) v1(45.21,10.62) v1(45.59,30.3) v1(48.13,7.19) v1(48.51,16.71) v1(48.77,20.01)
V3P3: length 8.6
  Top Layer w0.254: C5.2 28.15,2.11 29.08,2.11 29.34,2.36 29.34,3.89 29.04,4.19 U1.15 26.33,4.19 25.01,2.87 R29.1
VCC3.3: length 184.5
  Top Layer w0.254: 47.83,15.76 46.8,15.76 46.48,16.08 46.48,16.46 47.31,17.28 C28.1 47.31,18.93 v1(47.75,19.38) ; v1(35.38,4.65) C26.1 35.43,6.1 35.43,6.93 35.94,7.44 37.59,7.44 38.23,8.08 38.23,9.47 37.94,9.76 U12.13 ; 34.13,16.17 34.13,16.97 35.31,16.97 35.81,17.47 ; 34.13,16.17 33.91,15.95 30.99,15.95 ; 34.13,16.17 34.53,15.76 U12.1 ; U1.16 29.65,4.84 v1(29.97,5.16) 29.96,5.16 29.62,5.49 U1.17 ; C24.1 35.81,18.61 35.81,17.47 ; U1.25 29.41,10.69 29.72,11 30.11,10.6 X5.4 ; v1(46.49,4.65) 46.99,4.65 47.31,4.96 C27.1 47.31,6.87 46.48,7.69 46.1,7.69 45.83,7.43 U12.32 ; 35.81,17.47 36.58,17.47 37.59,16.46 38.1,16.46 38.33,16.69 38.33,17.76 ; v1(42.79,23.44) RN2.1 RN2.2 RN2.3 RN2.4 ; 40.4,22.63 40.4,19.52 v1(40.39,19.51) ; 39.33,6.26 39.33,4.68 40.07,3.95 C29.1 43.27,3.95 v1(43.6,4.28) ; v1(22.48,22.68) 21.59,23.57 19.56,23.57 19.35,23.78 R5.1 ; R2.1 18.41,31.7 17.78,31.06 17.78,27 17.02,26.24 U11.8 15.01,25.83 15.24,25.6 15.88,25.6 16.16,25.31 C2.2 16.13,24.42 16.13,23.7 15.23,22.8 15.23,21.15 v1(14.94,20.86) 14.69,20.6 11.43,20.6 11.27,20.44 Q4.2 10.6,19.95 10.16,19.51 10.16,16.97 10.48,16.65 Q2.2 ; 25.8,27.51 25.8,25.6 C37.1 25.84,24.52 26.52,23.84 26.52,23.08 26.92,22.68 C8.1 29.46,22.68 29.97,22.17 29.97,17.27 v1(29.16,16.46)
  Top Layer w0.4: X1.4 29.97,14.8 29.72,14.55 29.72,11
  Top Layer w0.6: X1.4 30.99,14.85 30.99,15.95 30.48,16.46 v1(29.16,16.46) v1(27.69,16.46) 27.14,17.01 U3.2
  Bottom Layer w0.254: v1(40.39,19.51) 42.79,21.91 v1(42.79,23.44) 45.85,23.44 47.75,21.54 v1(47.75,19.38)
  Bottom Layer w0.4: v1(29.16,16.46) 29.16,9.94 28.57,9.35 28.57,6.55 v1(29.97,5.16) 34.87,5.16 v1(35.38,4.65) 35.74,4.28 v1(43.6,4.28) 46.12,4.28 v1(46.49,4.65) 47.24,5.4 47.24,17.22 47.75,17.73 v1(47.75,19.38) ; v1(14.94,20.86) 16.76,22.68 v1(22.48,22.68) 25.91,19.25 25.91,17.09 26.54,16.46 v1(27.69,16.46)
1X1: length 18
  Top Layer w0.254: v1(44.96,24.08) 44.59,23.71 RN2.8 44.02,22.63 43.56,22.17 43.56,19.76 43.31,19.51 42.54,19.51 41.83,18.79 U12.57 ; U10.1 v1(43.73,30.68)
  Bottom Layer w0.254: v1(44.96,24.08) 43.73,25.3 v1(43.73,30.68)
1X2: length 25
  Top Layer w0.254: 42.33,17.76 v1(42.33,16.08) ; U10.2 38.65,27.43 39.24,28.02 44.58,28.02 45.85,26.75 v1(45.85,22.43) 45.25,21.83 RN2.7
  Bottom Layer w0.254: v1(42.33,16.08) 45.85,19.59 v1(45.85,22.43)
1X4: length 28.5
  Top Layer w0.254: v1(43.18,16.08) 42.83,16.42 U12.55 ; U10.4 38.65,30.13 39.88,28.9 44.83,28.9 46.48,27.25 v1(46.48,21.54) 45.97,21.03 RN2.6
  Bottom Layer w0.254: v1(43.18,16.08) 46.48,19.38 v1(46.48,21.54)
1X8: length 13.6
  Top Layer w0.254: U10.8 v1(44.96,25.66) ; v1(47.62,22.94) 47.62,21.16 46.7,20.23 RN2.5 44.59,19.52 44.2,19.12 43.57,19.12 43.33,18.89 43.33,17.76
  Bottom Layer w0.254: v1(47.62,22.94) 47.62,23 v1(44.96,25.66)
10X1: length 17.6
  Top Layer w0.254: v1(37.21,20.23) RN1.8 38.61,20.22 38.61,19.51 39.33,18.78 39.33,17.76 ; U9.1 v1(35.97,30.3)
  Bottom Layer w0.254: v1(37.21,20.23) 35.97,21.47 v1(35.97,30.3)
10X2: length 13.7
  Top Layer w0.254: U9.2 35.53,21.03 RN1.7 39.12,21.03 39.37,20.78 39.37,19.38 39.83,18.92 U12.61
10X4: length 25.5
  Top Layer w0.254: U9.4 30.9,31.41 34.67,27.63 34.67,23.19 36.07,21.79 38.56,21.79 RN1.6 39.28,21.83 39.5,22.05 39.5,23.06 39.75,23.32 41.02,23.32 41.28,23.06 41.28,19.51 40.83,19.06 U12.59
10X8: length 15.3
  Top Layer w0.254: 41.33,17.76 41.33,18.93 41.78,19.38 41.78,23.32 41.28,23.82 38.99,23.82 38.61,23.44 38.61,22.64 RN1.5 36.75,22.63 35.97,23.41 U9.8
+12IN: length 22.8
  Top Layer w0.8: U6.1 3.11,7 4.44,8.33 6.02,8.33 F3.1
  Bottom Layer w0.8: U4.1 2.97,22 3.81,21.16 3.81,7.82 2.99,7 U6.1
A: length 21.2
  Top Layer w0.254: F2.2 4.19,25.73 3.92,26 U4.3 3.17,24.65 3.17,19.89 2.67,19.38 2.67,14.3 3.17,13.79 3.17,12.27 1.91,11 U6.3
A+: length 19.8
  Top Layer w0.4: U1.5 20.39,10.04 v1(20.19,10.23)
  Bottom Layer w0.6: U5.4 7.2,3.85 9.65,6.3 15.82,6.3 19.75,10.23 v1(20.19,10.23)
A-: length 17
  Top Layer w0.4: U1.7 20.47,8.74 v1(20.45,8.71)
  Bottom Layer w0.6: v1(20.45,8.71) 19.69,8.71 16.26,5.28 10.79,5.28 9.2,3.69 U5.3
B: length 20.6
  Top Layer w0.254: F1.2 4.19,28.27 3.92,28 U4.4
  Bottom Layer w0.254: U4.4 0.64,26.81 0.64,14.19 U6.4
B+: length 11.9
  Top Layer w0.4: U1.10 21.19,6.79 20.83,6.42 v1(20.07,6.42)
  Bottom Layer w0.6: v1(20.07,6.42) 20.07,6.04 17.27,3.25 13.59,3.25 13.2,2.86 U5.1
B-: length 14.6
  Top Layer w0.4: v1(20.19,7.82) 20.7,7.82 20.97,8.09 U1.8
  Bottom Layer w0.6: U5.2 11.2,3.4 12.06,4.27 16.64,4.27 v1(20.19,7.82)
BOOT0: length 10.7
  Top Layer w0.254: 40.33,17.76 v1(40.33,15.95) ; R8.1 v1(34.19,19.76)
  Bottom Layer w0.254: v1(40.33,15.95) 36.52,19.76 v1(34.19,19.76)
DIR: length 16.3
  Top Layer w0.254: v1(29.59,6.81) 28.96,7.44 U1.20 ; U12.24 41.83,7.64 v1(41.53,7.95)
  Bottom Layer w0.254: v1(41.53,7.95) 41.28,8.2 40.26,8.2 38.86,6.81 v1(29.59,6.81)
ENABLE: length 17.4
  Top Layer w0.254: 42.33,6.26 42.33,8.29 v1(42.04,8.58) ; U1.21 29.2,8.09 v1(29.59,7.69)
  Bottom Layer w0.254: v1(29.59,7.69) 38.86,7.69 40.26,9.09 41.53,9.09 v1(42.04,8.58)
NRST: length 13.8
  Top Layer w0.254: U12.7 35.29,12.76 35.05,12.52 35.05,11.89 34.54,11.38 34.54,8.33 33.66,7.44 32.64,7.44 32.19,7 C23.1 32.19,4.2 31.75,3.76 31.75,2.17 SW1.1
OSC32_IN: length 3.1
  Top Layer w0.254: X1.3 34.29,14.8 34.33,14.76 U12.3
OSC_IN: length 5.5
  Top Layer w0.254: X5.3 33.23,11.33 33.78,11.89 34.16,11.89 34.54,12.27 34.54,13.41 34.9,13.76 U12.5
RXD: length 48
  Top Layer w0.254: R32.1 13.84,19.25 14.35,19.76 14.99,19.76 16.26,21.03 16.26,23.06 17.65,24.46 17.65,25.73 18.16,26.24 U11.1 22.48,26.24 22.86,25.86 v1(22.86,25.48) 22.86,25.09 22.22,24.46 R5.2 ; 47.83,13.26 46.25,13.26 v1(45.85,13.66)
  Bottom Layer w0.254: v1(45.85,13.66) 34.68,13.66 v1(22.86,25.48)
STEP: length 18.7
  Top Layer w0.254: v1(42.8,9.35) 42.8,6.3 U12.26 ; U1.22 28.04,8.71 v1(29.59,8.71)
  Bottom Layer w0.254: v1(29.59,8.71) 38.99,8.71 40.26,9.98 42.16,9.98 v1(42.8,9.35)
SWCLK: length 8.1
  Top Layer w0.254: H5.3 48.26,20.9 46.86,19.51 46.35,19.51 45.83,18.98 U12.49
SWDIO: length 14.3
  Top Layer w0.254: H5.2 49.53,25.88 49.53,15.33 48.96,14.76 47.83,14.76
TXD: length 50.2
  Top Layer w0.254: 47.83,12.76 45.6,12.76 45.09,13.28 v1(45.09,14.43) ; v1(18.67,25.47) 18.29,25.09 18.29,24.33 16.76,22.81 16.76,20.39 14.99,18.62 14.99,16.97 14.22,16.2 R31.1 ; R1.1 v1(22.86,27.25)
  Bottom Layer w0.254: v1(18.67,25.47) 20.45,27.25 v1(22.86,27.25) 35.69,14.43 v1(45.09,14.43)
$1N1217: length 2.8
  Top Layer w0.254: R1.2 22.86,31.57 23.31,32.02 Q1.1
$1N1218: length 10.4
  Top Layer w0.254: 18.92,29.16 18.92,27.89 19.3,27.51 20.55,27.51 ; 18.92,29.16 19.3,28.78 U11.3 ; 18.92,29.16 18.92,30.3 19.43,30.81 20.6,30.81 20.86,31.06 R2.2 20.86,32.37 Q1.3
$1N1230: length 18.8
  Top Layer w0.254: 11.81,29 11.81,31.73 D1.2 R3.2 ; 11.81,29 10.64,29 9.91,28.27 F1.1 ; 11.81,29 12.92,29 13.4,29.48 13.4,30.24 13.97,30.81 16.51,30.81 17.02,30.3 17.02,27.89 16.64,27.51 15.01,27.51
$1N1231: length 13.5
  Top Layer w0.254: R4.1 D2.1 11.81,22.27 11.81,25 ; F2.1 10.03,25.73 10.76,25 11.81,25 ; 11.81,25 11.81,26.24 13.46,27.89 13.46,28.51 13.73,28.78 U11.6
$1N2052: length 10.7
  Top Layer w0.254: C36.1 17.46,16.08 17.72,16.33 18.92,16.33 20.32,17.73 D4.1
  Top Layer w0.4: D4.1 22.73,17.73 23.39,17.07 U3.3 24.43,15.17 C4.1
$1N2058: length 2.2
  Top Layer w0.254: R35.1 27.71,27.91 27.71,29.54
$1N2061: length 2.1
  Top Layer w0.254: R36.2 19.06,22.04 LED7.2
$1N2619: length 2.3
  Top Layer w0.254: U12.30 44.83,3.97 C30.2
$1N4237: length 5.5
  Top Layer w0.254: U1.6 20.11,9.39 19.43,8.71 19.43,7.69 18.92,7.19 R26.2
$1N4238: length 5.3
  Top Layer w0.254: U1.9 21.09,7.44 20.71,7.06 19.81,7.06 19.22,6.47 19.22,5.84 18.67,5.28 R27.2
$1N4249: length 6.9
  Top Layer w0.254: 27.75,14.41 27.75,13.73 27.43,13.41 25.78,13.41 24.36,11.99 U1.2
$1N4250: length 4.8
  Top Layer w0.254: C34.1 25.67,14.41 25.65,14.43 23.86,12.64 U1.1
$1N4254: length 6.2
  Top Layer w0.254: 19.59,13 20.22,13 20.83,12.39 20.83,11.89 21.38,11.34 U1.3 ; 19.59,13 R28.2 ; 19.59,13 C35.1
$1N4266: length 8.2
  Top Layer w0.254: 23.88,3.97 23.88,4.65 23.04,5.49 U1.12 ; 23.88,3.97 23.01,4.84 U1.13 ; 23.88,3.97 23.88,3.63 23.5,3.26 R29.2 R30.1
$1N6482: length 1.7
  Top Layer w0.254: R31.2 12.9,14.75 Q2.1
$1N6521: length 1.8
  Top Layer w0.254: Q4.1 12.65,18.05 R32.2
$1N6755: length 1.8
  Top Layer w0.254: Q2.3 8.16,16.33 R33.2
$1N6756: length 2
  Top Layer w0.254: NOREF#2.2 R33.1
$1N6785: length 1.7
  Top Layer w0.254: R34.2 8.29,18.49 Q4.3
$1N6786: length 2
  Top Layer w0.254: NOREF#3.2 R34.1

## Copper pours and planes (outline as drawn; the poured copper is in the pictures)
GND on Top Layer: -1.78,36.91 52.2,36.91 52.2,-1.58 -1.78,-1.58
GND on Bottom Layer: -2.79,38.17 53.59,38.17 53.59,-2.59 -2.79,-2.59

Small or netless copper shapes (teardrops, artwork), in the pictures only: 260 on Top Layer, 55 on Bottom Layer

## Text on the board
Bottom Silkscreen Layer: B | A | V+ | GND | - | HY-SM-MB V1.1.02
